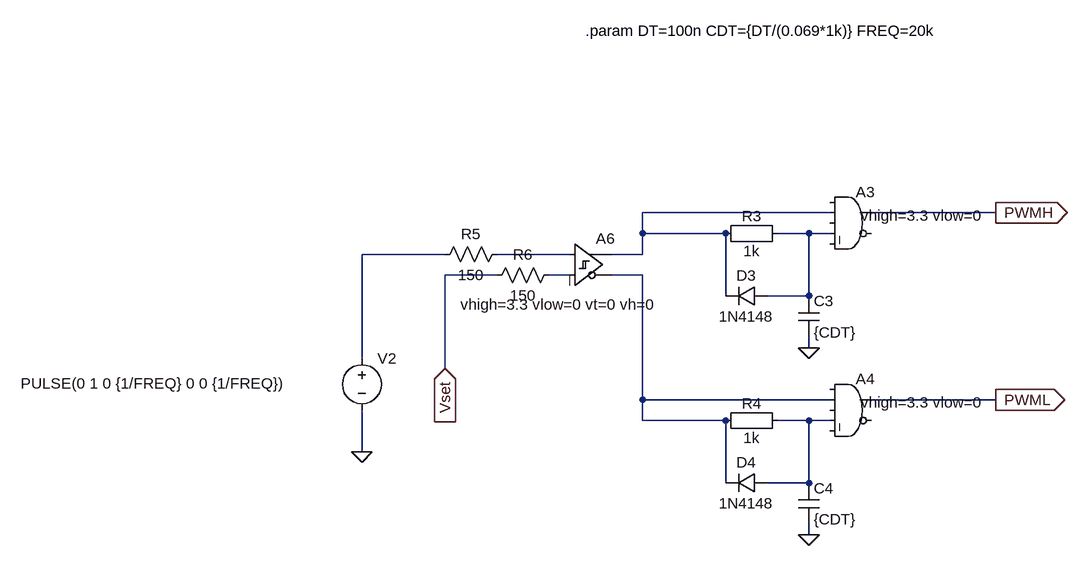
[diagram p0: schematic PWMGen.asc]
PWMGen.asc, the LTspice schematic file:
Version 4.1
SHEET 1 880 680
WIRE 384 0 96 0
WIRE 640 0 448 0
WIRE 96 32 96 0
WIRE 224 32 96 32
WIRE 352 32 304 32
WIRE 384 32 352 32
WIRE -208 64 -336 64
WIRE -16 64 -128 64
WIRE 96 64 96 32
WIRE 96 64 48 64
WIRE -128 96 -208 96
WIRE -16 96 -48 96
WIRE 96 96 48 96
WIRE 224 128 224 32
WIRE 352 128 352 32
WIRE 352 128 288 128
WIRE 352 208 352 192
WIRE -336 224 -336 64
WIRE -208 240 -208 96
WIRE 96 288 96 96
WIRE 384 288 96 288
WIRE 640 288 448 288
WIRE 96 320 96 288
WIRE 224 320 96 320
WIRE 352 320 304 320
WIRE 384 320 352 320
WIRE -336 368 -336 304
WIRE 224 416 224 320
WIRE 352 416 352 320
WIRE 352 416 288 416
WIRE 352 496 352 480
FLAG 352 208 0
FLAG -336 368 0
FLAG -208 240 Vset
IOPIN -208 240 In
FLAG 640 0 PWMH
IOPIN 640 0 Out
FLAG 352 496 0
FLAG 640 288 PWML
IOPIN 640 288 Out
DATAFLAG -336 368 ""
SYMBOL Digital\\and 416 -48 R0
WINDOW 39 16 52 Left 2
SYMATTR SpiceLine vhigh=3.3 vlow=0
SYMATTR InstName A3
SYMBOL Misc\\EuropeanResistor 320 16 R90
WINDOW 0 5 56 VBottom 2
WINDOW 3 27 56 VTop 2
SYMATTR InstName R3
SYMATTR Value 1k
SYMBOL diode 288 112 R90
WINDOW 0 0 32 VBottom 2
WINDOW 3 32 32 VTop 2
SYMATTR InstName D3
SYMATTR Value 1N4148
SYMBOL cap 336 128 R0
SYMATTR InstName C3
SYMATTR Value {CDT}
SYMBOL voltage -336 208 R0
WINDOW 3 -525 55 Left 2
WINDOW 123 0 0 Left 0
WINDOW 39 0 0 Left 0
SYMATTR Value PULSE(0 1 0 {1/FREQ} 0 0 {1/FREQ})
SYMATTR InstName V2
SYMBOL Digital\\and 416 240 R0
WINDOW 39 16 52 Left 2
SYMATTR SpiceLine vhigh=3.3 vlow=0
SYMATTR InstName A4
SYMBOL Misc\\EuropeanResistor 320 304 R90
WINDOW 0 5 56 VBottom 2
WINDOW 3 27 56 VTop 2
SYMATTR InstName R4
SYMATTR Value 1k
SYMBOL diode 288 400 R90
WINDOW 0 0 32 VBottom 2
WINDOW 3 32 32 VTop 2
SYMATTR InstName D4
SYMATTR Value 1N4148
SYMBOL cap 336 416 R0
SYMATTR InstName C4
SYMATTR Value {CDT}
SYMBOL Digital\\diffschmitt -16 16 R0
WINDOW 39 -168 125 Left 2
SYMATTR SpiceLine vhigh=3.3 vlow=0 vt=0 vh=0
SYMATTR InstName A6
SYMBOL res -112 48 R90
WINDOW 0 0 56 VBottom 2
WINDOW 3 32 56 VTop 2
SYMATTR InstName R5
SYMATTR Value 150
SYMBOL res -32 80 R90
WINDOW 0 0 56 VBottom 2
WINDOW 3 32 56 VTop 2
SYMATTR InstName R6
SYMATTR Value 150
TEXT 8 -280 Left 2 !.param DT=100n CDT={DT/(0.069*1k)} FREQ=20k

The netlist it stands for:
* PWMGen.asc
A3 0 N001 0 N002 0 0 PWMH 0 AND vhigh=3.3 vlow=0
R3 N002 N001 1k
D3 N002 N001 1N4148
C3 N002 0 {CDT}
V2 N003 0 PULSE(0 1 0 {1/FREQ} 0 0 {1/FREQ})
A4 0 N006 0 N007 0 0 PWML 0 AND vhigh=3.3 vlow=0
R4 N007 N006 1k
D4 N007 N006 1N4148
C4 N007 0 {CDT}
A6 N004 N005 0 0 0 N006 N001 0 SCHMITT vhigh=3.3 vlow=0 vt=0 vh=0
R5 N004 N003 150
R6 N005 Vset 150
.model D D
.lib standard.dio
.param DT=100n CDT={DT/(0.069*1k)} FREQ=20k
.backanno
.end